# EAGLE design Simple Heart v2 - spider (EAGLE 7.3.0)
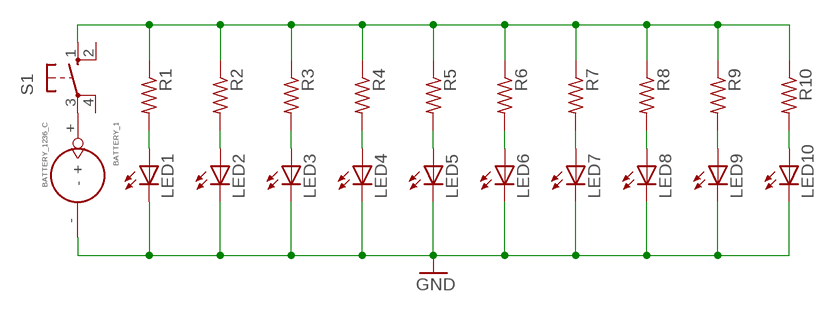
[diagram p0: schematic, sheet 1]

## Parts
BATTERY_1  BATTERY_1236_C  [BATTERY_1236_C]
LED1  LED5MM  [LED5MM]
LED2  LED5MM  [LED5MM]
LED3  LED5MM  [LED5MM]
LED4  LED5MM  [LED5MM]
LED5  LED5MM  [LED5MM]
LED6  LED5MM  [LED5MM]
LED7  LED5MM  [LED5MM]
LED8  LED5MM  [LED5MM]
LED9  LED5MM  [LED5MM]
LED10  LED5MM  [LED5MM]
R1  R-US_0204/7  [0204/7]
R2  R-US_0204/7  [0204/7]
R3  R-US_0204/7  [0204/7]
R4  R-US_0204/7  [0204/7]
R5  R-US_0204/7  [0204/7]
R6  R-US_0204/7  [0204/7]
R7  R-US_0204/7  [0204/7]
R8  R-US_0204/7  [0204/7]
R9  R-US_0204/7  [0204/7]
R10  R-US_0204/7  [0204/7]
S1  10-XX  [B3F-10XX]

## Nets
GND: BATTERY_1.- LED1.K(C) LED2.K(C) LED3.K(C) LED4.K(C) LED5.K(C) LED6.K(C) LED7.K(C) LED8.K(C) LED9.K(C) LED10.K(C)
N$1: LED1.A R1.2
N$2: LED2.A R2.2
N$3: LED3.A R3.2
N$4: LED4.A R4.2
N$5: LED5.A R5.2
N$6: LED6.A R6.2
N$7: LED7.A R7.2
N$8: LED8.A R8.2
N$9: LED9.A R9.2
N$10: LED10.A R10.2
N$11: BATTERY_1.+ S1.3(P)
N$12: R1.1 R2.1 R3.1 R4.1 R5.1 R6.1 R7.1 R8.1 R9.1 R10.1 S1.1(S)
Unconnected: S1.2(S1) S1.4(P1)

## Library data of the parts
BATTERY_1 = Itead_BP_110825:BATTERY_1236_C: SOC004
LED1-LED10 = led:LED: LED OSRAM: - CHIPLED LG R971, LG N971, LY N971, LG Q971, LY Q971, LO R971, LY R971 LH N974, LH R974 LS Q976, LO Q976, LY Q976 LO Q996 - Hyper CHIPLED LW Q18S LB Q993, LB Q99A, LB R99A - SideLED LS A670, LO A670, LY A670, LG A670, LP A670 LB A673, LV A673, LT A673, LW A673 LH A674 LY A675 LS A676, LA A676, LO A676, LY A676, LW A676 LS A679, LY A679, LG A679 - Hyper Micro SIDELED® LS Y876, LA Y876, LO Y876, LY Y876 LT Y87S - SmartLED LW L88C, LW L88S LB L89C, LB L89S, LG L890 LS L89K, LO L89K, LY L89K LS L896, LA L896, LO L896, LY L896 - TOPLED LS T670, LO T670, LY T670, LG T670, LP T670 LSG T670, LSP T670, LSY T670, LOP T670, LYG T670 LG T671, LOG T671, LSG T671 LB T673, LV T673, LT T673, LW T673 LH T674 LS T676, LA T676, LO T676, LY T676, LB T676, LH T676, LSB T676, LW T676 LB T67C, LV T67C, LT T67C, LS T67K, LO T67K, LY T67K, LW E67C LS E67B, LA E67B, LO E67B, LY E67B, LB E67C, LV E67C, LT E67C LW T67C LS T679, LY T679, LG T679 LS T770, LO T770, LY T770, LG T770, LP T770 LB T773, LV T773, LT T773, LW T773 LH T774 LS E675, LA E675, LY E675, LS T675 LS T776, LA T776, LO T776, LY T776, LB T776 LHGB T686 LT T68C, LB T68C - Hyper Mini TOPLED® LB M676 - Mini TOPLED Santana® LG M470 LS M47K, LO M47K, LY M47K Source: http://www.osram.convergy.de LUXEON: - LUMILED® LXK2-PW12-R00, LXK2-PW12-S00, LXK2-PW14-U00, LXK2-PW14-V00 LXK2-PM12-R00, LXK2-PM12-S00, LXK2-PM14-U00 LXK2-PE12-Q00, LXK2-PE12-R00, LXK2-PE12-S00, LXK2-PE14-T00, LXK2-PE14-U00 LXK2-PB12-K00, LXK2-PB12-L00, LXK2-PB12-M00, LXK2-PB14-N00, LXK2-PB14-P00, LXK2-PB14-Q00 LXK2-PR12-L00, LXK2-PR12-M00, LXK2-PR14-Q00, LXK2-PR14-R00 LXK2-PD12-Q00, LXK2-PD12-R00, LXK2-PD12-S00 LXK2-PH12-R00, LXK2-PH12-S00 LXK2-PL12-P00, LXK2-PL12-Q00, LXK2-PL12-R00 Source: www.luxeon.com KINGBRIGHT: KA-3528ASYC Source: www.kingbright.com
R1-R10 = resistor:R-US_: RESISTOR, American symbol
S1 = switch-omron:10-XX: OMRON SWITCH; MPN: B3F-1000; OC_FARNELL: 176432; OC_NEWARK: 36M3542

## Board
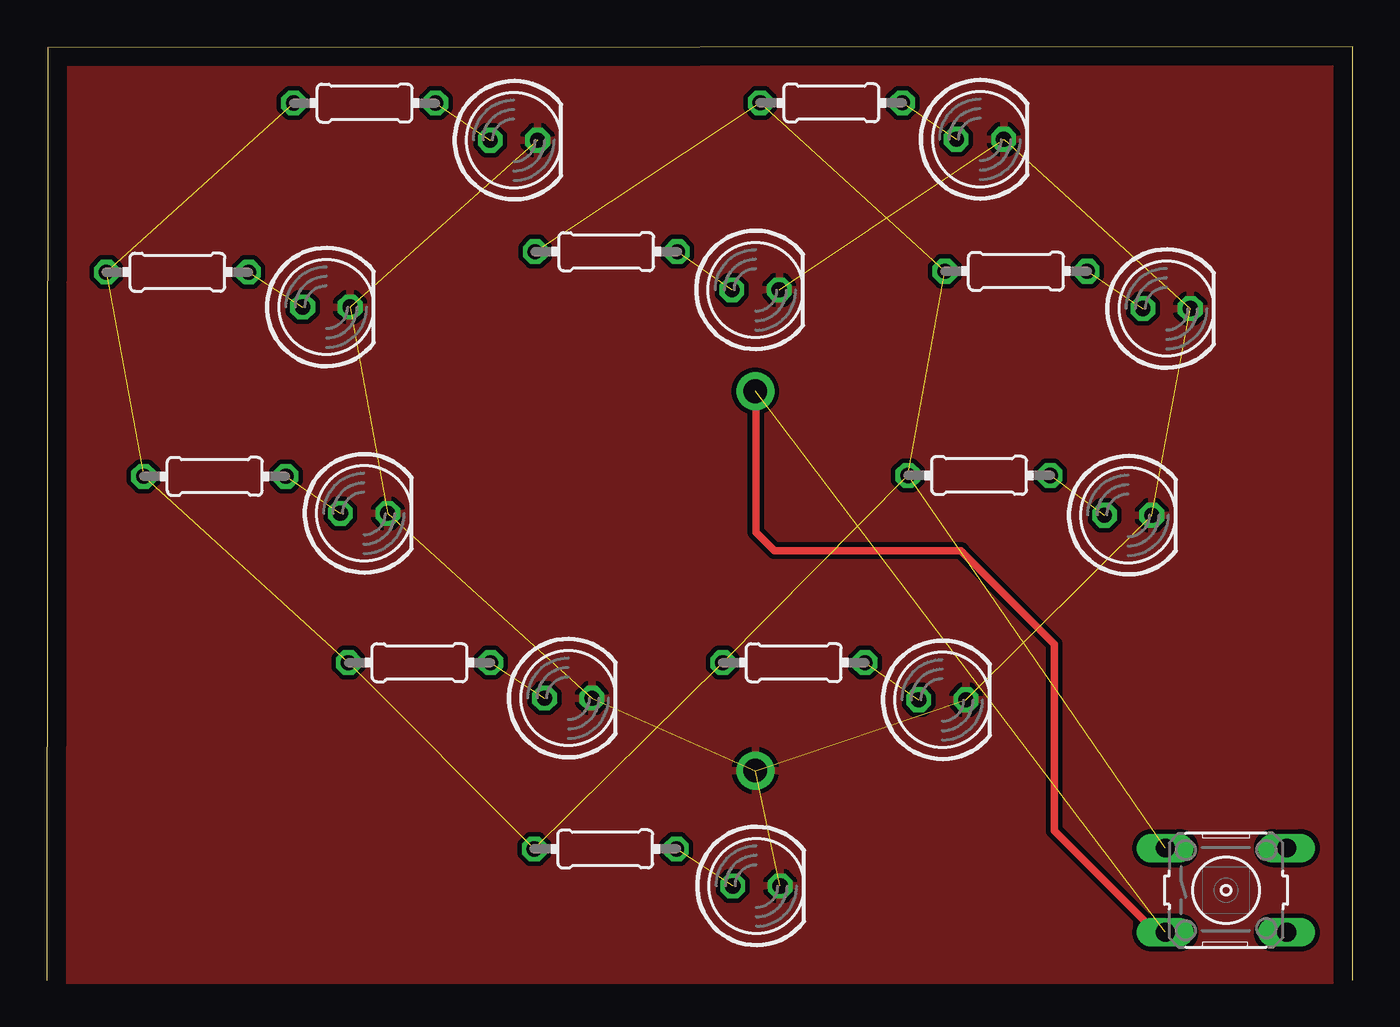
[diagram p1: board, top side]
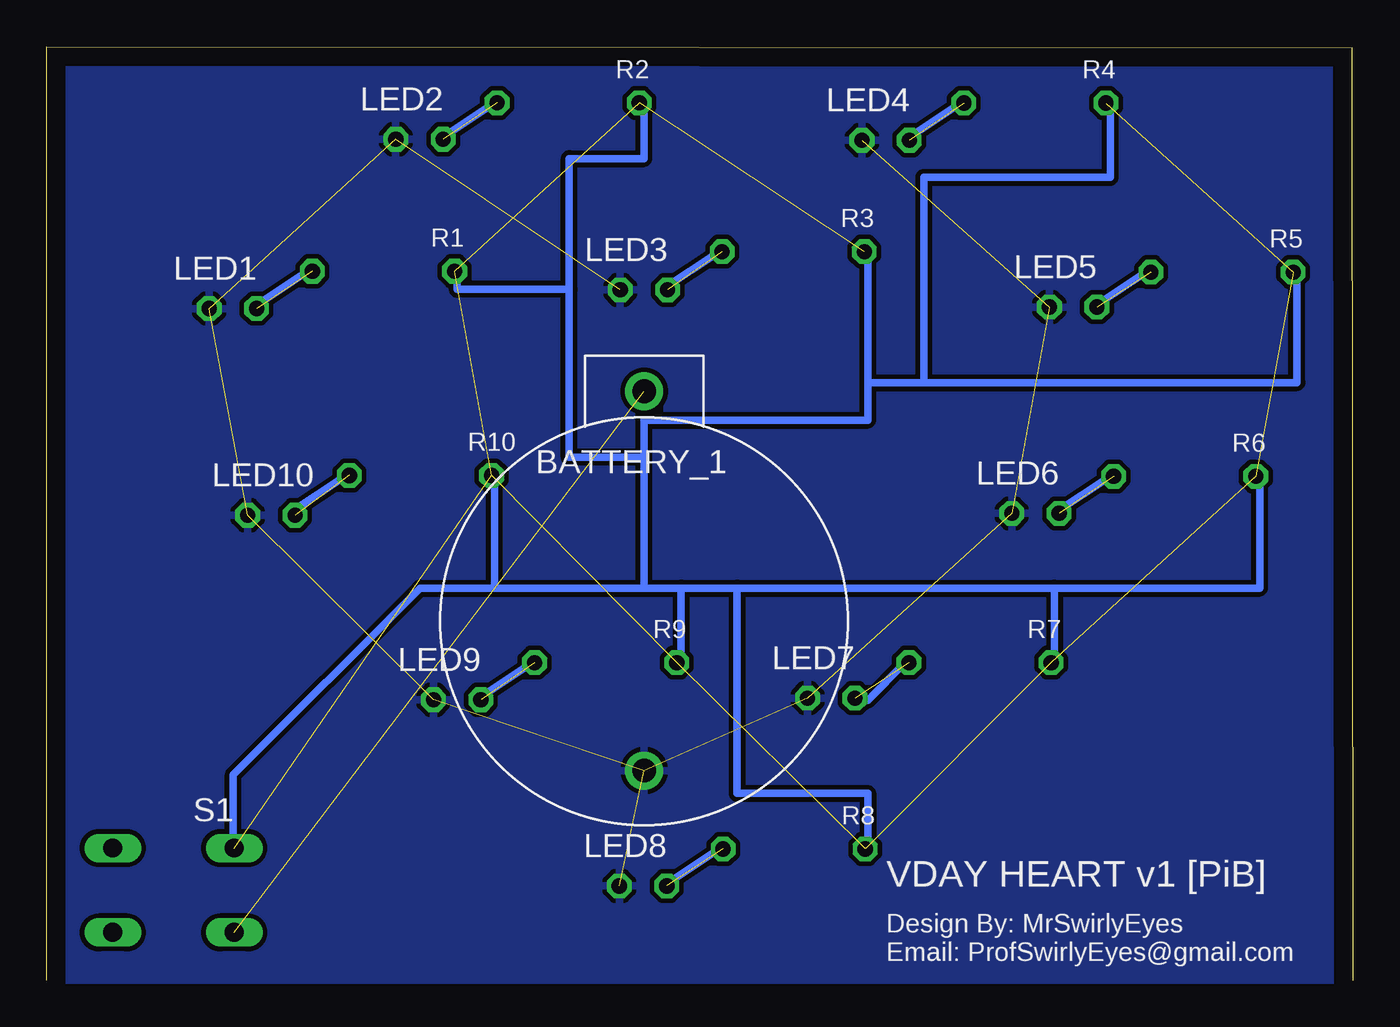
[diagram p2: board, bottom side, seen from below]

Size 70 x 50 mm. Coordinates in mm from the lower left corner, seen from the top.
Outline: 70,0 70,50 0.05,49.93 0,0
Copper layers (1*16): Top 0.035mm / dielectric 1.5mm / Bottom 0.035mm
Design rules "default": minimum track width 10mil, minimum drill 24mil, track to track 8mil, track to pad 8mil, pad to pad 8mil, via to via 8mil, smd to smd 8mil, copper to edge 40mil, drill to drill 8mil, minimum pad ring 10mil, minimum via ring 8mil, stop-mask expansion 4mil, vias tented up to drill 0mil, thermal gap 10mil

### Footprints (pad centres in the part's own frame; a part is rotated, then mirrored left to right if it is on the bottom)
BATTERY_1236_C = drill 1.27 pad 2.032: + 0,0; - 0,20.32
LED5MM = drill 0.813 octagon: A -1.27,0; K 1.27,0
0204/7 = drill 0.813 octagon: 1 -3.81,0; 2 3.81,0
B3F-10XX = drill 1.016 long: 1 -3.251,2.261; 2 3.251,2.261; 3 -3.251,-2.261; 4 3.251,-2.261

### Placement (x,y rotation side)
BATTERY_1  37.98,31.54 180 bottom
LED1  60.02,35.97 0 top
LED2  50.02,45.04 0 top
LED3  37.99,36.97 0 top
LED4  25.04,44.99 0 top
LED5  14.99,36.05 0 top
LED6  17.01,25 0 top
LED7  27.95,15.1 0 top
LED8  38.04,5.04 0 top
LED9  48,15.01 0 top
LED10  57.96,24.9 0 top
R1  51.95,37.97 0 top
R2  42.05,46.99 0 top
R3  29.99,39.02 0 top
R4  17.04,46.98 0 top
R5  7.01,37.92 0 top
R6  9.01,26.98 0 top
R7  19.98,17 0 top
R8  29.94,7.02 0 top
R9  40.04,17 0 top
R10  49.97,27.03 0 top
S1  63.2,4.81 0 top

### Tracks (layer width: path | path; a pad name or v marks a point on that pad's centre or on a via)
GND  (10 unrouted)
  pour Bottom (isolate 0.254): 0,50 70,50 70,0 0,0
  pour Top (isolate 0.254): 0,50 70,50 70,0 0,0
N$1  (1 unrouted)
N$2  (1 unrouted)
N$3  (1 unrouted)
N$4  (1 unrouted)
N$5  (1 unrouted)
N$6  (1 unrouted)
N$7  (1 unrouted)
N$8  (1 unrouted)
N$9  (1 unrouted)
N$10  (1 unrouted)
N$11  (1 unrouted)
N$12  (10 unrouted)
N$13
  Bottom 0.406: 37,5 34,7
N$14
  Bottom 0.406: 26,15 24,17
N$15
  Bottom 0.406: 16,25 13,27
N$16
  Bottom 0.406: 14,36 11,38
N$17
  Bottom 0.406: 24,45 21,47
N$18
  Bottom 0.406: 37,37 34,39
N$19
  Bottom 0.406: 49,45 46,47
N$20
  Bottom 0.406: 59,36 56,38
N$21
  Bottom 0.406: 57,25 54,27
N$22
  Bottom 0.406: 47,15 44,17
N$23
  Bottom 0.406: 60,7 60,11 50,21 46,21 | 46,21 38,21 | 38,21 38,28 | 38,28 38,30 26,30 26,32 | 26,32 23,32 | 23,32 3,32 3,38 | 38,21 36,21 | 36,21 33,21 | 33,21 16,21 | 16,21 5,21 5,27 | 16,21 16,17 | 36,21 36,17 | 46,21 46,27 | 38,28 42,28 42,37 | 42,37 42,44 38,44 38,47 | 42,37 48,37 48,38 | 33,21 33,10 26,10 26,7 | 23,32 23,43 13,43 13,47 | 26,32 26,39
N$24
  Top 0.406: 60,2 54,8 54,18 49,23 39,23 38,24 38,31

### Text on the board
bPlace: VDAY HEART v1 [PiB] | Design By: MrSwirlyEyes / Email: ProfSwirlyEyes@gmail.com